# Altium schematic sheet [02].LORA.SchDoc
size 533 x 241 mm; Organization: Altium Limited; Address1: L3, 12a Rodborough Rd; Address2: Frenchs Forest; Address3: NSW; Address4: Australia 2086
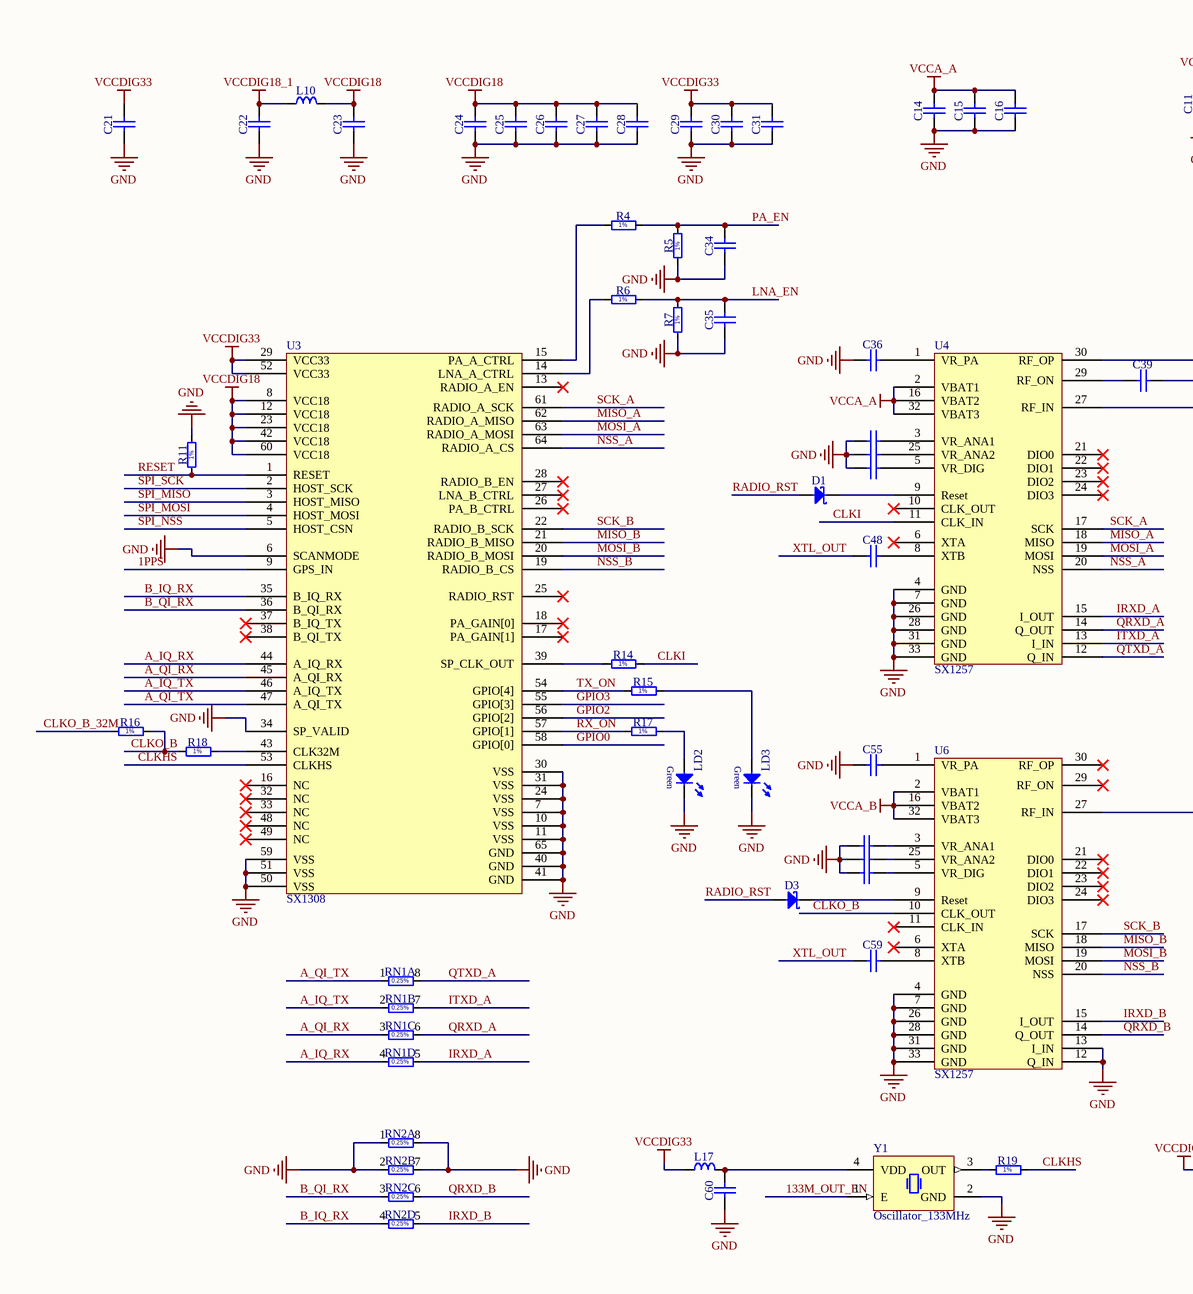
[diagram p0: [02].LORA.SchDoc, left]
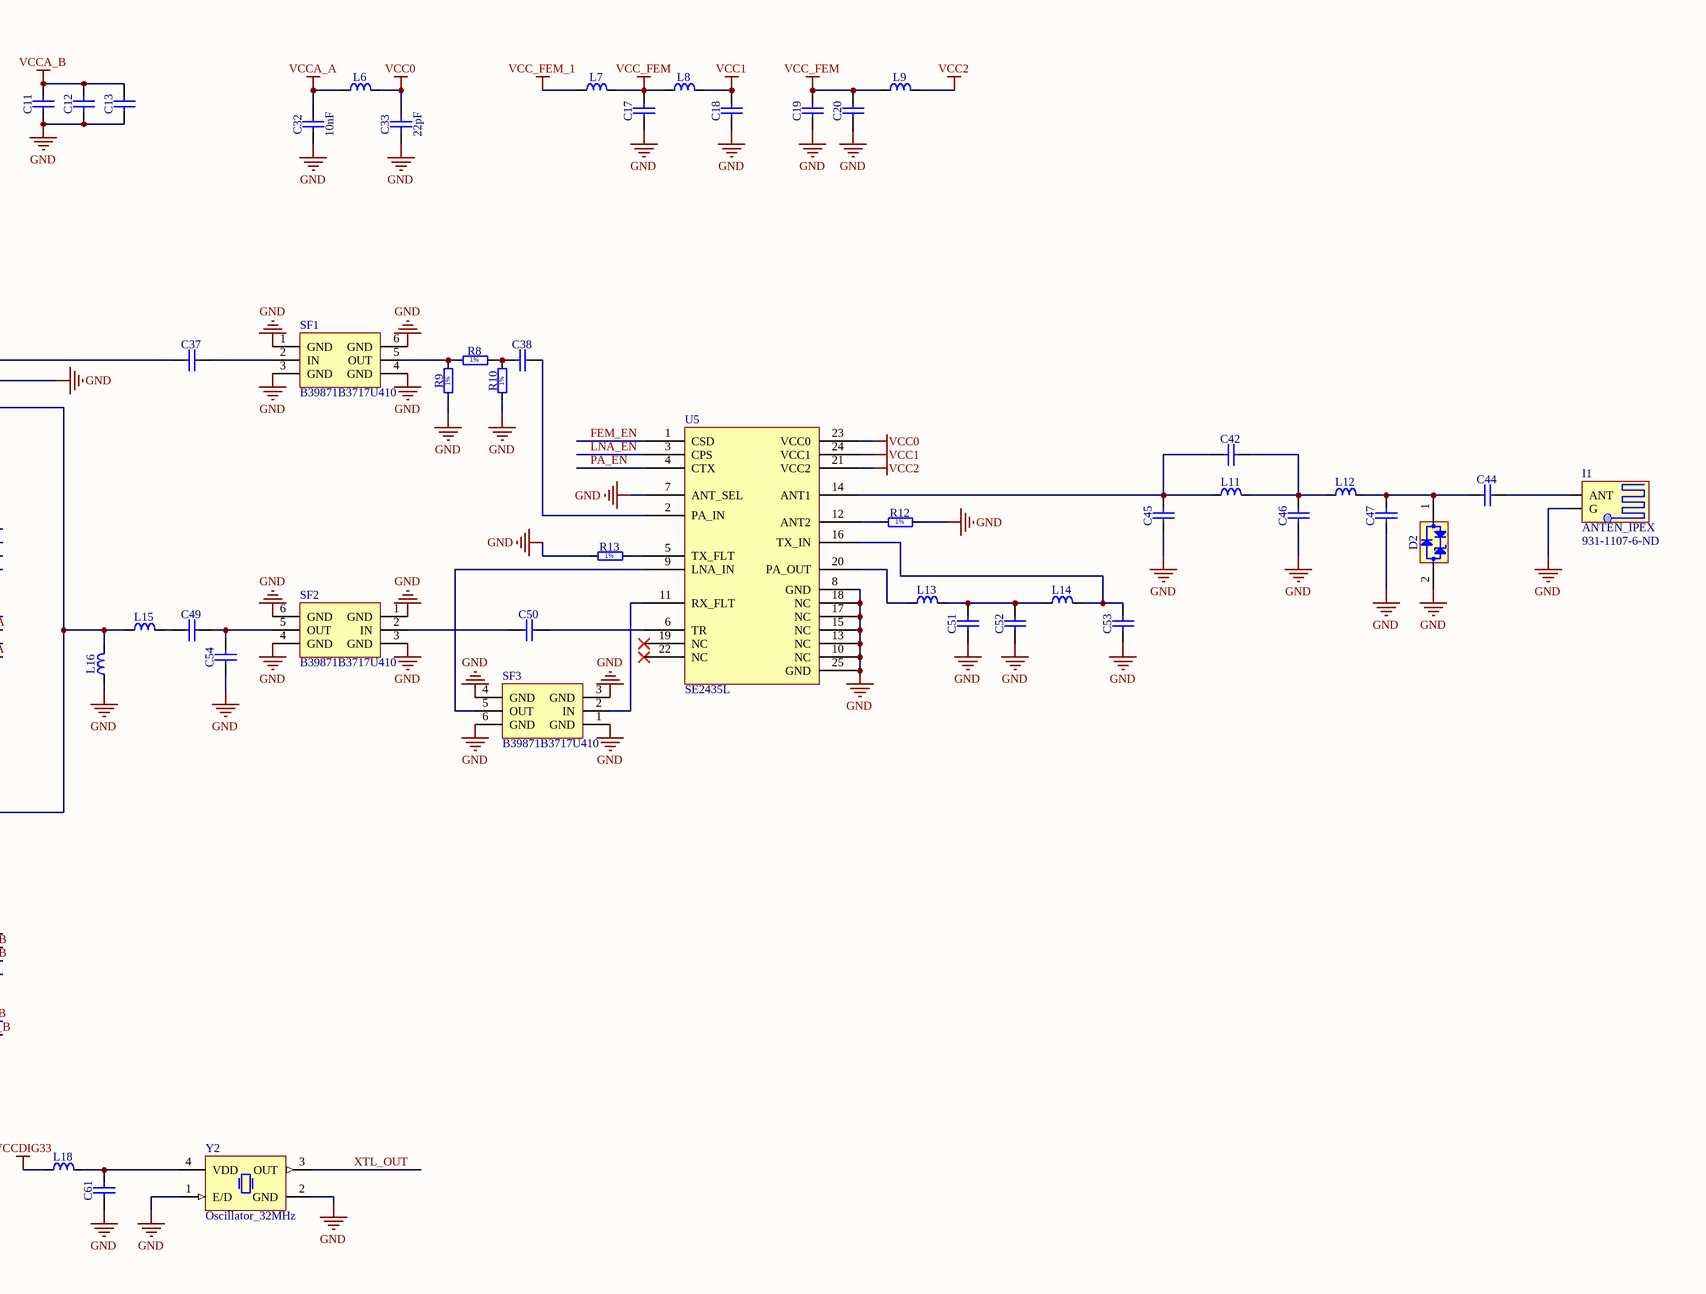
[diagram p1: [02].LORA.SchDoc, right]

## Parts
C11  100nF  [CAPC1005X55N]  (value not drawn)
C12  100nF  [CAPC1005X55N]  (value not drawn)
C13  100nF  [CAPC1005X55N]  (value not drawn)
C14  100nF  [CAPC1005X55N]  (value not drawn)
C15  100nF  [CAPC1005X55N]  (value not drawn)
C16  100nF  [CAPC1005X55N]  (value not drawn)
C17  4.7uF  [CAPC1005X55N]  (value not drawn)
C18  150pF  [CAPC1005X55N]  (value not drawn)
C19  1nF  [CAPC1005X55N]  (value not drawn)
C20  33pF  [CAPC1005X55N]  (value not drawn)
C21  10uF  [CAPC1005X55N]  (value not drawn)
C22  10uF  [CAPC1005X55N]  (value not drawn)
C23  1uF  [CAPC1005X55N]  (value not drawn)
C24  100nF  [CAPC1005X55N]  (value not drawn)
C25  100nF  [CAPC1005X55N]  (value not drawn)
C26  100nF  [CAPC1005X55N]  (value not drawn)
C27  100nF  [CAPC1005X55N]  (value not drawn)
C28  100nF  [CAPC1005X55N]  (value not drawn)
C29  100nF  [CAPC1005X55N]  (value not drawn)
C30  100nF  [CAPC1005X55N]  (value not drawn)
C31  100nF  [CAPC1005X55N]  (value not drawn)
C32  10nF  [CAPC1005X55N]
C33  22pF  [CAPC1005X55N]
C34  56pF  [CAPC1005X55N]  (value not drawn)
C35  56pF  [CAPC1005X55N]  (value not drawn)
C36  10uF  [CAPC1005X55N]  (value not drawn)
C37  56pF  [CAPC1005X55N]  (value not drawn)
C38  3.3pF  [CAPC1005X55N]  (value not drawn)
C39  56pF  [CAPC1005X55N]  (value not drawn)
C40  1uF  [CAPC1005X55N]  (value not drawn)
C41  1uF  [CAPC1005X55N]  (value not drawn)
C42  33pF  [CAPC1005X55N]  (value not drawn)
C43  1uF  [CAPC1005X55N]  (value not drawn)
C44  33pF  [CAPC1005X55N]  (value not drawn)
C45  33pF  [CAPC1005X55N]  (value not drawn)
C46  33pF  [CAPC1005X55N]  (value not drawn)
C47  33pF  [CAPC1005X55N]  (value not drawn)
C48  1uF  [CAPC1005X55N]  (value not drawn)
C49  56pF  [CAPC1005X55N]  (value not drawn)
C50  56pF  [CAPC1005X55N]  (value not drawn)
C51  33pF  [CAPC1005X55N]  (value not drawn)
C52  33pF  [CAPC1005X55N]  (value not drawn)
C53  33pF  [CAPC1005X55N]  (value not drawn)
C54  5.6pF  [CAPC1005X55N]  (value not drawn)
C55  10uF  [CAPC1005X55N]  (value not drawn)
C56  1uF  [CAPC1005X55N]  (value not drawn)
C57  1uF  [CAPC1005X55N]  (value not drawn)
C58  1uF  [CAPC1005X55N]  (value not drawn)
C59  1uF  [CAPC1005X55N]  (value not drawn)
C60  100nF  [CAPC1005X55N]  (value not drawn)
C61  100nF  [CAPC1005X55N]  (value not drawn)
D1  PMEG4002EB  [SODFL1608X65N]  (value not drawn)
D2  ESD5V3L1U-02LRH  [DFN100X60X40-2N]  (value not drawn)
D3  PMEG4002EB  [SODFL1608X65N]  (value not drawn)
I1  ANTEN_IPEX  Supplier Part Number 1: 931-1107-6-ND  [ANTEN_IPEX]
L6  1k@100MHz  [INDC1005X55N]  (value not drawn)
L7  600R@100MHz  [INDC1005X55N]  (value not drawn)
L8  1k@100MHz  [INDC1005X55N]  (value not drawn)
L9  1k@100MHz  [INDC1005X55N]  (value not drawn)
L10  600R@100MHz  [INDC1005X55N]  (value not drawn)
L11  1k@100MHz  [INDC1005X55N]  (value not drawn)
L12  1k@100MHz  [INDC1005X55N]  (value not drawn)
L13  1k@100MHz  [INDC1005X55N]  (value not drawn)
L14  1k@100MHz  [INDC1005X55N]  (value not drawn)
L15  1k@100MHz  [INDC1005X55N]  (value not drawn)
L16  1k@100MHz  [INDC1005X55N]  (value not drawn)
L17  600R@100MHz  [INDC1005X55N]  (value not drawn)
L18  600R@100MHz  [INDC1005X55N]  (value not drawn)
LD2  Green  [LED_OSRAM_LGL29K]  (value not drawn)
LD3  Green  [LED_OSRAM_LGL29K]  (value not drawn)
R4  100  [RESC1005X40N]  (value not drawn)
R5  0  [RESC1005X40N]  (value not drawn)
R6  100  [RESC1005X40N]  (value not drawn)
R7  0  [RESC1005X40N]  (value not drawn)
R8  18  [RESC1005X40N]  (value not drawn)
R9  300  [RESC1005X40N]  (value not drawn)
R10  300  [RESC1005X40N]  (value not drawn)
R11  10k  [RESC1005X40N]  (value not drawn)
R12  150  [RESC1005X40N]  (value not drawn)
R13  150  [RESC1005X40N]  (value not drawn)
R14  100  [RESC1005X40N]  (value not drawn)
R15  470  [RESC1005X40N]  (value not drawn)
R16  100  [RESC1005X40N]  (value not drawn)
R17  470  [RESC1005X40N]  (value not drawn)
R18  100  [RESC1005X40N]  (value not drawn)
R19  0  [RESC1005X40N]  (value not drawn)
RN1  100  [RN_VISHAY_ACAS0612]  (value not drawn)  (parts A,B,C,D of 4)
RN2  100  [RN_VISHAY_ACAS0612]  (value not drawn)  (parts A,B,C,D of 4)
SF1  B39871B3717U410  [SAW_Filter]
SF2  B39871B3717U410  [SAW_Filter]
SF3  B39871B3717U410  [SAW_Filter]
U3  SX1308  [SX1308]
U4  SX1257  [SX1257]
U5  SE2435L  [SE2435L]
U6  SX1257  [SX1257]
Y1  Oscillator_133MHz  [OSCILLATOR_133MHz]
Y2  Oscillator_32MHz  [TCXO_32MHz]

## Nets
GND: C11.1 C12.1 C13.1 C14.1 C15.1 C16.1 C17.1 C18.1 C19.1 C20.1 C21.1 C22.1 C23.1 C24.1 C25.1 C26.1 C27.1 C28.1 C29.1 C30.1 C31.1 C32.1 C33.1 C34.1 C35.1 C36.1 C39.2 C40.1 C41.1 C43.1 C45.1 C46.1 C47.1 C51.1 C52.1 C53.1 C54.1 C55.1 C56.1 C57.1 C58.1 C60.1 C61.1 D2.2(I/O1) I1.2(G) L16.1 LD2.1(C) LD3.1(C) R5.1 R7.1 R9.1 R10.1 R11.2 R12.2 R13.1 RN2.1 RN2.2 RN2.7 RN2.8 SF1.1(GND) SF1.3(GND) SF1.4(GND) SF1.6(GND) SF2.1(GND) SF2.3(GND) SF2.4(GND) SF2.6(GND) SF3.1(GND) SF3.3(GND) SF3.4(GND) SF3.6(GND) U3.6(SCANMODE) U3.7(VSS) U3.10(VSS) U3.11(VSS) U3.24(VSS) U3.30(VSS) U3.31(VSS) U3.34(SP_VALID) U3.40(GND) U3.41(GND) U3.50(VSS) U3.51(VSS) U3.59(VSS) U3.65(GND) U4.4(GND) U4.7(GND) U4.26(GND) U4.28(GND) U4.31(GND) U4.33(GND) U5.7(ANT_SEL) U5.8(GND) U5.10(NC) U5.13(NC) U5.15(NC) U5.17(NC) U5.18(NC) U5.25(GND) U6.4(GND) U6.7(GND) U6.12(Q_IN) U6.13(I_IN) U6.26(GND) U6.28(GND) U6.31(GND) U6.33(GND) Y1.2(GND) Y2.1(E/D) Y2.2(GND)
VCC0: C33.2 L6.2 U5.23(VCC0)
VCC1: C18.2 L8.2 U5.24(VCC1)
VCC2: L9.2 U5.21(VCC2)
VCC_FEM: C17.2 C19.2 C20.2 L7.2 L8.1 L9.1
VCC_FEM_1: L7.1
VCCA_A: C14.2 C15.2 C16.2 C32.2 L6.1 U4.2(VBAT1) U4.16(VBAT2) U4.32(VBAT3)
VCCA_B: C11.2 C12.2 C13.2 U6.2(VBAT1) U6.16(VBAT2) U6.32(VBAT3)
VCCDIG18: C23.2 C24.2 C25.2 C26.2 C27.2 C28.2 L10.2 U3.8(VCC18) U3.12(VCC18) U3.23(VCC18) U3.42(VCC18) U3.60(VCC18)
VCCDIG18_1: C22.2 L10.1
VCCDIG33: C21.2 C29.2 C30.2 C31.2 L17.1 L18.1 U3.29(VCC33) U3.52(VCC33)
1PPS: U3.9(GPS_IN)
133M_OUT_EN: Y1.1(E)
A_IQ_RX: RN1.4 U3.44(A_IQ_RX)
A_IQ_TX: RN1.2 U3.46(A_IQ_TX)
A_QI_RX: RN1.3 U3.45(A_QI_RX)
A_QI_TX: RN1.1 U3.47(A_QI_TX)
B_IQ_RX: RN2.4 U3.35(B_IQ_RX)
B_QI_RX: RN2.3 U3.36(B_QI_RX)
CLKHS: R19.2 U3.53(CLKHS)
CLKI: R14.2 U4.11(CLK_IN)
CLKO_B: R16.2 R18.1 U6.10(CLK_OUT)
CLKO_B_32M: R16.1
FEM_EN: U5.1(CSD)
GPIO0: U3.58(GPIO[0])
GPIO2: U3.56(GPIO[2])
GPIO3: U3.55(GPIO[3])
IRXD_A: RN1.5 U4.15(I_OUT)
IRXD_B: RN2.5 U6.15(I_OUT)
ITXD_A: RN1.7 U4.13(I_IN)
LNA_EN: C35.2 R6.2 R7.2 U5.3(CPS)
MISO_A: U3.62(RADIO_A_MISO) U4.18(MISO)
MISO_B: U3.21(RADIO_B_MISO) U6.18(MISO)
MOSI_A: U3.63(RADIO_A_MOSI) U4.19(MOSI)
MOSI_B: U3.20(RADIO_B_MOSI) U6.19(MOSI)
NSS_A: U3.64(RADIO_A_CS) U4.20(NSS)
NSS_B: U3.19(RADIO_B_CS) U6.20(NSS)
PA_EN: C34.2 R4.2 R5.2 U5.4(CTX)
QRXD_A: RN1.6 U4.14(Q_OUT)
QRXD_B: RN2.6 U6.14(Q_OUT)
QTXD_A: RN1.8 U4.12(Q_IN)
RADIO_RST: D1.2(A) D3.2(A)
RESET: R11.1 U3.1(RESET)
RX_ON: R17.1 U3.57(GPIO[1])
SCK_A: U3.61(RADIO_A_SCK) U4.17(SCK)
SCK_B: U3.22(RADIO_B_SCK) U6.17(SCK)
SPI_MISO: U3.3(HOST_MISO)
SPI_MOSI: U3.4(HOST_MOSI)
SPI_NSS: U3.5(HOST_CSN)
SPI_SCK: U3.2(HOST_SCK)
TX_ON: R15.1 U3.54(GPIO[4])
XTL_OUT: C48.1 C59.1 Y2.3(OUT)
NetC36_2: C36.2 U4.1(VR_PA)
NetC37_1: C37.1 U4.30(RF_OP)
NetC37_2: C37.2 SF1.2(IN)
NetC38_1: C38.1 R8.2 R10.2
NetC38_2: C38.2 U5.2(PA_IN)
NetC39_1: C39.1 U4.29(RF_ON)
NetC40_2: C40.2 U4.3(VR_ANA1)
NetC41_2: C41.2 U4.25(VR_ANA2)
NetC42_1: C42.1 C45.2 L11.1 U5.14(ANT1)
NetC42_2: C42.2 C46.2 L11.2 L12.1
NetC43_2: C43.2 U4.5(VR_DIG)
NetC44_1: C44.1 C47.2 D2.1(GND) L12.2
NetC44_2: C44.2 I1.1(ANT)
NetC48_2: C48.2 U4.8(XTB)
NetC49_1: C49.1 L15.2
NetC49_2: C49.2 C54.2 SF2.5(OUT)
NetC50_1: C50.1 SF2.2(IN)
NetC50_2: C50.2 U5.6(TR)
NetC51_2: C51.2 C52.2 L13.2 L14.1
NetC53_2: C53.2 L14.2 U5.16(TX_IN)
NetC55_2: C55.2 U6.1(VR_PA)
NetC56_2: C56.2 U6.3(VR_ANA1)
NetC57_2: C57.2 U6.25(VR_ANA2)
NetC58_2: C58.2 U6.5(VR_DIG)
NetC59_2: C59.2 U6.8(XTB)
NetC60_2: C60.2 L17.2 Y1.4(VDD)
NetC61_2: C61.2 L18.2 Y2.4(VDD)
NetD1_1: D1.1(C) U4.9(Reset)
NetD3_1: D3.1(C) U6.9(Reset)
NetL13_1: L13.1 U5.20(PA_OUT)
NetL15_1: L15.1 L16.2 U4.27(RF_IN) U6.27(RF_IN)
NetLD2_2: LD2.2(A) R17.2
NetLD3_2: LD3.2(A) R15.2
NetR4_1: R4.1 U3.15(PA_A_CTRL)
NetR6_1: R6.1 U3.14(LNA_A_CTRL)
NetR8_1: R8.1 R9.2 SF1.5(OUT)
NetR12_1: R12.1 U5.12(ANT2)
NetR13_2: R13.2 U5.5(TX_FLT)
NetR14_1: R14.1 U3.39(SP_CLK_OUT)
NetR18_2: R18.2 U3.43(CLK32M)
NetR19_1: R19.1 Y1.3(OUT)
NetSF3_2: SF3.2(IN) U5.11(RX_FLT)
NetSF3_5: SF3.5(OUT) U5.9(LNA_IN)

Not connected (* = marked no-connect by the designer): U3 13(RADIO_A_EN)* 16(NC)* 17(PA_GAIN[1])* 18(PA_GAIN[0])* 25(RADIO_RST)* 26(PA_B_CTRL)* 27(LNA_B_CTRL)* 28(RADIO_B_EN)* 32(NC)* 33(NC)* 37(B_IQ_TX)* 38(B_QI_TX)* 48(NC)* 49(NC)*; U4 6(XTA)* 10(CLK_OUT)* 21(DIO0)* 22(DIO1)* 23(DIO2)* 24(DIO3)*; U5 19(NC)* 22(NC)*; U6 6(XTA)* 11(CLK_IN)* 21(DIO0)* 22(DIO1)* 23(DIO2)* 24(DIO3)* 29(RF_ON)* 30(RF_OP)*

## Notes on the sheet
- Title
- Size:
- Date:
- B
- Number:
- Time:
- Revision:
- Sheet
- of
- File:
- (in symbol R0402_0R_JUMPER) 1%
- (in symbol R0402_10K_1%_0.0625W_100PPM) 1%
- (in symbol R0402_18R_1%_0.0625W_100PPM) 1%
- (in symbol R0402_100R_1%_0.0625W_100PPM) 1%
- (in symbol R0402_150R_1%_0.0625W_100PPM) 1%
- (in symbol R0402_300R_1%_0.0625W_100PPM) 1%
- (in symbol R0402_470R_1%_0.0625W_100PPM) 1%
- (in symbol RN_100R_VISHAY_ACASA1000E1000P100, part A) 0.25%
- (in symbol RN_100R_VISHAY_ACASA1000E1000P100, part B) 0.25%
- (in symbol RN_100R_VISHAY_ACASA1000E1000P100, part C) 0.25%
- (in symbol RN_100R_VISHAY_ACASA1000E1000P100, part D) 0.25%

## Library data of the parts
C11-C16 C24-C31 C60 C61 = CC0402_100NF_16V_10%_X7R: Non-polarised capacitor; Part Description: SMD Multilayer Chip Ceramic Capacitor; Manufacturer: GENERIC; Manufacturer1 Part Number: 223878715649; Voltage: 16V; TC: X7R; Tolerance: ±10%; Table: Capacitors SMD; Part Number: CC0402_100NF_16V_10%_X7R; Component Kind: Standard; Component Type: Standard; Pin Count: 2; Value: 100nF; Status: Not Recommended; Manufacturer Part Number: CC0402_100NF_16V_10%_X7R; Case: 0402; Mounted: Yes; Socket: No; SMD: Yes; Manufacturer1 Example: PHYCOMP; Manufacturer1 ComponentHeight: 0.55mm; HelpURL: \\cern.ch\dfs\Applications\Altium\Datasheets\CC0402_X7R_PHYCOMP.pdf; Author: CERN DEM JLC; CreateDate: 12/3/2007; LatestRevisionDate: 12/3/2007
C17 = CC0402_4.7UF_4V_20%_X5R: Non-polarised capacitor; Part Description: SMD Multilayer Chip Ceramic Capacitor; Manufacturer: GENERIC; Manufacturer1 Part Number: C0402C475M7PAC; Voltage: 4V; TC: X5R; Tolerance: ±20%; Table: Capacitors SMD; Part Number: CC0402_4.7UF_4V_20%_X5R; Component Kind: Standard; Component Type: Standard; Pin Count: 2; Value: 4.7uF; Status: Preferred; Manufacturer Part Number: CC0402_4.7UF_4V_20%_X5R; Case: 0402; Mounted: Yes; Socket: No; SMD: Yes; Manufacturer1 Example: KEMET; Manufacturer1 ComponentHeight: 0.55mm; HelpURL: \\cern.ch\dfs\Applications\Altium\Datasheets\CC0402_X5R_KEMET.pdf; Author: CERN DEM JLC; CreateDate: 6/8/2010; LatestRevisionDate: 6/8/2010
C18 = CC0402_150PF_50V_5%_NP0: Non-polarised capacitor; Part Description: SMD Multilayer Chip Ceramic Capacitor; Manufacturer: GENERIC; Manufacturer1 Part Number: 223886915151; Voltage: 50V; TC: NP0; Tolerance: ±5%; Table: Capacitors SMD; Part Number: CC0402_150PF_50V_5%_NP0; Component Kind: Standard; Component Type: Standard; Pin Count: 2; Value: 150pF; Status: Not Recommended; Manufacturer Part Number: CC0402_150PF_50V_5%_NP0; Case: 0402; Mounted: Yes; Socket: No; SMD: Yes; Manufacturer1 Example: PHYCOMP; Manufacturer1 ComponentHeight: 0.55mm; HelpURL: \\cern.ch\dfs\Applications\Altium\Datasheets\CC0402_NP0_PHYCOMP.pdf; Author: CERN DEM JLC; CreateDate: 12/3/2007; LatestRevisionDate: 12/3/2007
C19 = CC0402_1NF_50V_10%_X7R: Non-polarised capacitor; Part Description: SMD Multilayer Chip Ceramic Capacitor; Manufacturer: GENERIC; Manufacturer1 Part Number: 223858715623; Voltage: 50V; TC: X7R; Tolerance: ±10%; Table: Capacitors SMD; Part Number: CC0402_1NF_50V_10%_X7R; Component Kind: Standard; Component Type: Standard; Pin Count: 2; Value: 1nF; Status: Not Recommended; Manufacturer Part Number: CC0402_1NF_50V_10%_X7R; Case: 0402; Mounted: Yes; Socket: No; SMD: Yes; Manufacturer1 Example: PHYCOMP; Manufacturer1 ComponentHeight: 0.55mm; HelpURL: \\cern.ch\dfs\Applications\Altium\Datasheets\CC0402_X7R_PHYCOMP.pdf; Author: CERN DEM JLC; CreateDate: 12/3/2007; LatestRevisionDate: 12/3/2007
C20 C42 C44-C47 C51-C53 = CC0402_33PF_50V_5%_NP0: Non-polarised capacitor; Part Description: SMD Multilayer Chip Ceramic Capacitor; Manufacturer: GENERIC; Manufacturer1 Part Number: 223886915339; Voltage: 50V; TC: NP0; Tolerance: ±5%; Table: Capacitors SMD; Part Number: CC0402_33PF_50V_5%_NP0; Component Kind: Standard; Component Type: Standard; Pin Count: 2; Value: 33pF; Status: Not Recommended; Manufacturer Part Number: CC0402_33PF_50V_5%_NP0; Case: 0402; Mounted: Yes; Socket: No; SMD: Yes; Manufacturer1 Example: PHYCOMP; Manufacturer1 ComponentHeight: 0.55mm; HelpURL: \\cern.ch\dfs\Applications\Altium\Datasheets\CC0402_NP0_PHYCOMP.pdf; Author: CERN DEM JLC; CreateDate: 12/3/2007; LatestRevisionDate: 12/3/2007
C21 C22 C36 C55 = CC0603_10UF_6.3V_20%_X5R: Non-polarised capacitor; Part Description: SMD Multilayer Chip Ceramic Capacitor; Manufacturer: GENERIC; Manufacturer1 Part Number: C0603C106M9PAC; Voltage: 6.3V; TC: X5R; Tolerance: ±20%; Table: Capacitors SMD; Part Number: CC0603_10UF_6.3V_20%_X5R; Component Kind: Standard; Component Type: Standard; Footprint: CAPC1608X87N; Pin Count: 2; Value: 10uF; Status: Preferred; Manufacturer Part Number: CC0603_10uF_6.3V_20%_X5R; Case: 0603; Mounted: Yes; Socket: No; SMD: Yes; Manufacturer1 Example: KEMET; Manufacturer1 ComponentHeight: 0.95mm; HelpURL: \\cern.ch\dfs\Applications\Altium\Datasheets\CC0603_X5R_KEMET.pdf; Author: CERN DEM JLC; CreateDate: 12/3/2007; LatestRevisionDate: 12/3/2007
C23 C40 C41 C43 C48 C56-C59 = CC0402_1UF_16V_10%_X5R: Non-polarised capacitor; Part Description: SMD Multilayer Chip Ceramic Capacitor; Manufacturer: GENERIC; Manufacturer1 Part Number: C1005X5R1C105KT; Voltage: 16V; TC: X5R; Tolerance: ±10%; Table: Capacitors SMD; Part Number: CC0402_1UF_16V_10%_X5R; Component Kind: Standard; Component Type: Standard; Pin Count: 2; Value: 1uF; Status: Preferred; Manufacturer Part Number: CC0402_1UF_16V_10%_X5R; Case: 0402; Mounted: Yes; Socket: No; SMD: Yes; Manufacturer1 Example: TDK; Manufacturer1 ComponentHeight: 0.55mm; HelpURL: \\cern.ch\dfs\Applications\Altium\Datasheets\CC0402_X5R_TDK_C.pdf; Author: CERN DEM JLC; CreateDate: 10/25/2012; LatestRevisionDate: 10/25/2012
C32 = CC0402_10NF_25V_10%_X7R: Non-polarised capacitor; Part Description: SMD Multilayer Chip Ceramic Capacitor; Manufacturer: GENERIC; Manufacturer1 Part Number: C1005X7R1E103KT; Voltage: 25V; TC: X7R; Tolerance: ±10%; Table: Capacitors SMD; Part Number: CC0402_10NF_25V_10%_X7R; Component Kind: Standard; Component Type: Standard; Pin Count: 2; Value: 10nF; Status: Preferred; Manufacturer Part Number: CC0402_10NF_25V_10%_X7R; Case: 0402; Mounted: Yes; Socket: No; SMD: Yes; Manufacturer1 Example: TDK; Manufacturer1 ComponentHeight: 0.55mm; HelpURL: \\cern.ch\dfs\Applications\Altium\Datasheets\CC0402_X7R_TDK_C.pdf; Author: CERN DEM JLC; CreateDate: 10/25/2012; LatestRevisionDate: 10/25/2012
C33 = CC0402_22PF_50V_5%_NP0: Non-polarised capacitor; Part Description: SMD Multilayer Chip Ceramic Capacitor; Manufacturer: GENERIC; Manufacturer1 Part Number: 223886915229; Voltage: 50V; TC: NP0; Tolerance: ±5%; Table: Capacitors SMD; Part Number: CC0402_22PF_50V_5%_NP0; Component Kind: Standard; Component Type: Standard; Pin Count: 2; Value: 22pF; Status: Not Recommended; Manufacturer Part Number: CC0402_22PF_50V_5%_NP0; Case: 0402; Mounted: Yes; Socket: No; SMD: Yes; Manufacturer1 Example: PHYCOMP; Manufacturer1 ComponentHeight: 0.55mm; HelpURL: \\cern.ch\dfs\Applications\Altium\Datasheets\CC0402_NP0_PHYCOMP.pdf; Author: CERN DEM JLC; CreateDate: 12/3/2007; LatestRevisionDate: 12/3/2007
C34 C35 C37 C39 C49 C50 = CC0603_56PF_50V_5%_NP0: Non-polarised capacitor; Part Description: SMD Multilayer Chip Ceramic Capacitor; Manufacturer: GENERIC; Manufacturer1 Part Number: 223886715569; Voltage: 50V; TC: NP0; Tolerance: ±5%; Table: Capacitors SMD; Part Number: CC0603_56PF_50V_5%_NP0; Component Kind: Standard; Component Type: Standard; Footprint: CAPC1608X87N; Pin Count: 2; Value: 56pF; Status: Preferred; Manufacturer Part Number: CC0603_56PF_50V_5%_NP0; Case: 0603; Mounted: Yes; Socket: No; SMD: Yes; Manufacturer1 Example: PHYCOMP; Manufacturer1 ComponentHeight: 0.87mm; HelpURL: \\cern.ch\dfs\Applications\Altium\Datasheets\CC0603_NP0_PHYCOMP.pdf; Author: CERN DEM JLC; CreateDate: 12/3/2007; LatestRevisionDate: 12/3/2007
C38 = CC0402_3.3PF_50V_0.25PF_NP0: Non-polarised capacitor; Part Description: SMD Multilayer Chip Ceramic Capacitor; Manufacturer: GENERIC; Manufacturer1 Part Number: 223886915338; Voltage: 50V; TC: NP0; Tolerance: ±0.25pF; Table: Capacitors SMD; Part Number: CC0402_3.3PF_50V_0.25PF_NP0; Component Kind: Standard; Component Type: Standard; Pin Count: 2; Value: 3.3pF; Status: Not Recommended; Manufacturer Part Number: CC0402_3.3PF_50V_0.25PF_NP0; Case: 0402; Mounted: Yes; Socket: No; SMD: Yes; Manufacturer1 Example: PHYCOMP; Manufacturer1 ComponentHeight: 0.55mm; HelpURL: \\cern.ch\dfs\Applications\Altium\Datasheets\CC0402_NP0_PHYCOMP.pdf; Author: CERN DEM JLC; CreateDate: 12/3/2007; LatestRevisionDate: 12/3/2007
C54 = CC0603_5.6PF_50V_0.5PF_NP0: Non-polarised capacitor; Part Description: SMD Multilayer Chip Ceramic Capacitor; Manufacturer: GENERIC; Manufacturer1 Part Number: 223886715568; Voltage: 50V; TC: NP0; Tolerance: ±0.5pF; Table: Capacitors SMD; Part Number: CC0603_5.6PF_50V_0.5PF_NP0; Component Kind: Standard; Component Type: Standard; Footprint: CAPC1608X87N; Pin Count: 2; Value: 5.6pF; Status: Preferred; Manufacturer Part Number: CC0603_5.6PF_50V_0.5PF_NP0; Case: 0603; Mounted: Yes; Socket: No; SMD: Yes; Manufacturer1 Example: PHYCOMP; Manufacturer1 ComponentHeight: 0.87mm; HelpURL: \\cern.ch\dfs\Applications\Altium\Datasheets\CC0603_NP0_PHYCOMP.pdf; Author: CERN DEM JLC; CreateDate: 12/3/2007; LatestRevisionDate: 12/3/2007
D1 D3 = PMEG4002EB: Schottky Diode; Part Description: Very Low VF MEGA Schottky Barrier Rectifier; Manufacturer: NXP SEMICONDUCTORS; Voltage: 40V; Power: 200mA; Table: Diodes; Part Number: PMEG4002EB; Component Kind: Standard; Component Type: Standard; Device: PMEG4002EB; PackageDescription: Ultra Small Outline Diode Flat Lead (SOD-523), Body; 1.2mm L X 0.8mm W X 0.65mm H, IPC Medium Density; Manufacturer Part Number: PMEG4002EB; Pin Count: 2; Case: SOD523; Mounted: Yes; Socket: No; SMD: Yes; ComponentHeight: 0.65mm; HelpURL: \\cern.ch\dfs\Applications\Altium\Datasheets\PMEG4002EB.pdf; Author: CERN DEM JMW; CreateDate: 4/21/2009; LatestRevisionDate: 5/7/2009
D2 = ESD5V3L1U-02LRH: 30kV ESD Low Capacitance TVS Diode; Part Description: 30kV ESD Low Capacitance Uni-Directional TVS Diode; Manufacturer: INFINEON; Voltage: 5.3V; Table: Diodes; Part Number: ESD5V3L1U-02LRH; Component Kind: Standard; Component Type: Standard; Device: ESD5V3L1U-02LRH; PackageDescription: DFN; 2 pin,1.00mm L X 0.60mm W X 0.40mm H, IPC Medium Density; Manufacturer Part Number: ESD5V3L1U-02LRH; Pin Count: 2; Case: DFN2; Mounted: Yes; Socket: No; SMD: Yes; ComponentHeight: 0.4mm; HelpURL: \\cern.ch\dfs\Applications\Altium\Datasheets\ESD5V3L1U-02LRH.pdf; Author: CERN DEM JLC; CreateDate: 3/13/2012; LatestRevisionDate: 3/13/2012
I1 = ANTEN_IPEX: CONN UMC RCPT STR 50 OHM SMD; Manufacturer: Taoglas; Manufacturer Part Number: RECE.20279.001E.01; Body Material: Brass; Body Plating: Gold; Connector Type: Coaxial,Male Pin; Gender: Male; Supplier 1: Digi-Key; Stock 1: 45630; Pricing 1: 1=0.75 (USD); Mount: Surface Mount; Case/Package: SMD/SMT; Contact Material: Brass; Contact Plating: Gold; Housing Color: White; Package Quantity: 1; Packaging: Tape and Reel; Termination: Solder; Orientation: Straight; Fastening Type: Snap
L6 L8 L9 L11-L16 = IND0402_MURATA_BLM15HD102SN1: Inductor; Part Description: SMD EMIFIL Suppression Chip Ferrite Bead; Manufacturer: MURATA; Manufacturer Part Number: BLM15HD102SN1D; Power: 250mA; Resistance: 1.25R; Tolerance: ±25%; Table: Inductors SMD; Part Number: IND0402_MURATA_BLM15HD102SN1; Component Kind: Standard; Component Type: Standard; Pin Count: 2; Value: 1k@100MHz; Status: None; Case: 0402; Mounted: Yes; Socket: No; SMD: Yes; ComponentHeight: 0.55mm; HelpURL: \\cern.ch\dfs\Applications\Altium\Datasheets\IND0402_MURATA_BLM15H.pdf; Author: CERN DEM JLC; CreateDate: 3/6/2012; LatestRevisionDate: 3/6/2012
L7 L10 L17 L18 = IND0402_MURATA_BLM15HD601SN1: Inductor; Part Description: SMD EMIFIL Suppression Chip Ferrite Bead; Manufacturer: MURATA; Manufacturer Part Number: BLM15HD601SN1D; Power: 300mA; Resistance: 0.85R; Tolerance: ±25%; Table: Inductors SMD; Part Number: IND0402_MURATA_BLM15HD601SN1; Component Kind: Standard; Component Type: Standard; Pin Count: 2; Value: 600R@100MHz; Status: None; Case: 0402; Mounted: Yes; Socket: No; SMD: Yes; ComponentHeight: 0.55mm; HelpURL: \\cern.ch\dfs\Applications\Altium\Datasheets\IND0402_MURATA_BLM15H.pdf; Author: CERN DEM JLC; CreateDate: 2/28/2012; LatestRevisionDate: 2/28/2012
LD2 LD3 = LED_OSRAM_LG L29K-G2J1-24-Z: LED Green 1C 2A; Part Description: Surface Mount Green LED (0603 Case); Manufacturer: OSRAM; Table: LEDs & Displays; Part Number: LED_OSRAM_LG L29K-G2J1-24-Z; Component Kind: Standard; Component Type: Standard; Color: Green; PackageDescription: Green Chip LED, 2-Leads, Body 1.7x0.8mm, IPC Medium Density; Manufacturer Part Number: LG L29K-G2J1-24-Z; Pin Count: 2; Case: 0603; Mounted: Yes; Socket: No; SMD: Yes; ComponentHeight: 0.67mm; HelpURL: \\cern.ch\dfs\Applications\Altium\Datasheets\LED_OSRAM_LGL29K.pdf; Author: CERN DEM JLC; CreateDate: 4/24/2012; LatestRevisionDate: 4/24/2012
R4 R6 R14 R16 R18 = R0402_100R_1%_0.0625W_100PPM: Resistor - 1%; Part Description: General Purpose Thick Film Chip Resistor; Manufacturer: GENERIC; Manufacturer1 Part Number: 232270671001L; TC: ±100ppm/°C; Table: Resistors SMD; Part Number: R0402_100R_1%_0.0625W_100PPM; Component Kind: Standard; Component Type: Standard; Pin Count: 2; Value: 100; Status: Not recommended; Power: 0.0625W; Tolerance: ±1%; Manufacturer Part Number: R0402_100R_1%_0.0625W_100PPM; Case: 0402; Mounted: Yes; Socket: No; SMD: Yes; Manufacturer1 Example: YAGEO PHYCOMP; Manufacturer1 ComponentHeight: 0.4mm; HelpURL: \\cern.ch\dfs\Applications\Altium\Datasheets\R0402_Phycomp_RC0402.pdf; Author: CERN DEM JLC; CreateDate: 12/3/2007; LatestRevisionDate: 10/17/2012
R5 R7 R19 = R0402_0R_JUMPER: Resistor - 1%; Part Description: 1A (0.05R Max DC Resistance) Zero Ohm Jumper; Manufacturer: GENERIC; Manufacturer1 Part Number: 232270591001L; Table: Resistors SMD; Part Number: R0402_0R_JUMPER; Component Kind: Standard; Component Type: Standard; Pin Count: 2; Value: 0; Status: Not recommended; Manufacturer Part Number: R0402_0R_JUMPER; Case: 0402; Mounted: Yes; Socket: No; SMD: Yes; Manufacturer1 Example: YAGEO PHYCOMP; Manufacturer1 ComponentHeight: 0.4mm; HelpURL: \\cern.ch\dfs\Applications\Altium\Datasheets\R0402_Phycomp_RC0402.pdf; Author: CERN DEM JLC; CreateDate: 12/3/2007; LatestRevisionDate: 10/17/2012
R8 = R0402_18R_1%_0.0625W_100PPM: Resistor - 1%; Part Description: General Purpose Thick Film Chip Resistor; Manufacturer: GENERIC; Manufacturer1 Part Number: 232270671809L; TC: ±100ppm/°C; Table: Resistors SMD; Part Number: R0402_18R_1%_0.0625W_100PPM; Component Kind: Standard; Component Type: Standard; Pin Count: 2; Value: 18; Status: Not recommended; Power: 0.0625W; Tolerance: ±1%; Manufacturer Part Number: R0402_18R_1%_0.0625W_100PPM; Case: 0402; Mounted: Yes; Socket: No; SMD: Yes; Manufacturer1 Example: YAGEO PHYCOMP; Manufacturer1 ComponentHeight: 0.4mm; HelpURL: \\cern.ch\dfs\Applications\Altium\Datasheets\R0402_Phycomp_RC0402.pdf; Author: CERN DEM JLC; CreateDate: 12/3/2007; LatestRevisionDate: 10/17/2012
R9 R10 = R0402_300R_1%_0.0625W_100PPM: Resistor - 1%; Part Description: General Purpose Thick Film Chip Resistor; Manufacturer: GENERIC; Manufacturer1 Part Number: 232270673001L; TC: ±100ppm/°C; Table: Resistors SMD; Part Number: R0402_300R_1%_0.0625W_100PPM; Component Kind: Standard; Component Type: Standard; Pin Count: 2; Value: 300; Status: Not recommended; Power: 0.0625W; Tolerance: ±1%; Manufacturer Part Number: R0402_300R_1%_0.0625W_100PPM; Case: 0402; Mounted: Yes; Socket: No; SMD: Yes; Manufacturer1 Example: YAGEO PHYCOMP; Manufacturer1 ComponentHeight: 0.4mm; HelpURL: \\cern.ch\dfs\Applications\Altium\Datasheets\R0402_Phycomp_RC0402.pdf; Author: CERN DEM JLC; CreateDate: 12/3/2007; LatestRevisionDate: 10/17/2012
R11 = R0402_10K_1%_0.0625W_100PPM: Resistor - 1%; Part Description: General Purpose Thick Film Chip Resistor; Manufacturer: GENERIC; Manufacturer1 Part Number: 232270671003L; TC: ±100ppm/°C; Table: Resistors SMD; Part Number: R0402_10K_1%_0.0625W_100PPM; Component Kind: Standard; Component Type: Standard; Pin Count: 2; Value: 10k; Status: Not recommended; Power: 0.0625W; Tolerance: ±1%; Manufacturer Part Number: R0402_10K_1%_0.0625W_100PPM; Case: 0402; Mounted: Yes; Socket: No; SMD: Yes; Manufacturer1 Example: YAGEO PHYCOMP; Manufacturer1 ComponentHeight: 0.4mm; HelpURL: \\cern.ch\dfs\Applications\Altium\Datasheets\R0402_Phycomp_RC0402.pdf; Author: CERN DEM JLC; CreateDate: 12/3/2007; LatestRevisionDate: 10/17/2012
R12 R13 = R0402_150R_1%_0.0625W_100PPM: Resistor - 1%; Part Description: General Purpose Thick Film Chip Resistor; Manufacturer: GENERIC; Manufacturer1 Part Number: 232270671501L; TC: ±100ppm/°C; Table: Resistors SMD; Part Number: R0402_150R_1%_0.0625W_100PPM; Component Kind: Standard; Component Type: Standard; Pin Count: 2; Value: 150; Status: Not recommended; Power: 0.0625W; Tolerance: ±1%; Manufacturer Part Number: R0402_150R_1%_0.0625W_100PPM; Case: 0402; Mounted: Yes; Socket: No; SMD: Yes; Manufacturer1 Example: YAGEO PHYCOMP; Manufacturer1 ComponentHeight: 0.4mm; HelpURL: \\cern.ch\dfs\Applications\Altium\Datasheets\R0402_Phycomp_RC0402.pdf; Author: CERN DEM JLC; CreateDate: 12/3/2007; LatestRevisionDate: 10/17/2012
R15 R17 = R0402_470R_1%_0.0625W_100PPM: Resistor - 1%; Part Description: General Purpose Thick Film Chip Resistor; Manufacturer: GENERIC; Manufacturer1 Part Number: 232270674701L; TC: ±100ppm/°C; Table: Resistors SMD; Part Number: R0402_470R_1%_0.0625W_100PPM; Component Kind: Standard; Component Type: Standard; Pin Count: 2; Value: 470; Status: Not recommended; Power: 0.0625W; Tolerance: ±1%; Manufacturer Part Number: R0402_470R_1%_0.0625W_100PPM; Case: 0402; Mounted: Yes; Socket: No; SMD: Yes; Manufacturer1 Example: YAGEO PHYCOMP; Manufacturer1 ComponentHeight: 0.4mm; HelpURL: \\cern.ch\dfs\Applications\Altium\Datasheets\R0402_Phycomp_RC0402.pdf; Author: CERN DEM JLC; CreateDate: 12/3/2007; LatestRevisionDate: 10/17/2012
RN1 RN2 = RN_100R_VISHAY_ACASA1000E1000P100: DIL8 Resistor Network 4 Isolated Resistor 0.25%; Part Description: Chip Resistor Array , 4 Isolated Resistor (Convex Terminal), ACAS 0612 Serie; Manufacturer: VISHAY  BEYSCHLAG; Power: 0.1W; TC: ±25ppm/°C; Table: Resistor Networks SMD; Part Number: RN_100R_VISHAY_ACASA1000E1000P100; Component Kind: Standard; Component Type: Standard; Pin Count: 8; Value: 100; Tolerance: ±0.25%; Manufacturer Part Number: ACASA1000E1000P100; Case: 1206; Mounted: Yes; Socket: No; SMD: Yes; ComponentHeight: 0.55mm; HelpURL: \\cern.ch\dfs\Applications\Altium\Datasheets\RN_VISHAY_ACAS0612.pdf; Author: CERN DEM JLC; CreateDate: 5/12/2011; LatestRevisionDate: 5/12/2011
SF1-SF3 = B3717: FILTER SAW 866.5MHZ SMD; Manufacturer: TDK EPCOS; Load Impedance: 50R; Insertion Loss: 2.1dB; Frequency Tolerance: 100ppm; Supplier 1: Newark; Manufacturer Part Number: B39871B3717U410; Stock 1: 0; Pricing 1: 9000 = 0.74900 (USD); RoHS: Yes; Mount: Surface Mount; Case/Package: SMD/SMT; Number of Pins: 6; Contact Plating: Gold; Min Operating Temperature: -40°C; Max Operating Temperature: 125°C; Package Quantity: 1; Frequency: 866.5MHz; Packaging: Tape and Reel; Impedance: 50R; Termination: SMD/SMT; Length: 3mm; Height: 0.043inch; Width: 0.118inch; Radiation Hardening: No; ComponentLink1URL: https://datasheet.ciiva.com/16552/b3717-16552772.pdf?src-supplier=Avnet+Europe; ComponentLink1Description: https://datasheet.ciiva.com/16552/b3717-16552772.pdf?src-supplier=Avnet+Europe; ComponentLink2URL: https://datasheet.ciiva.com/14132/loepcos-breitbandfiler-b3981-en-14132665.pdf?src-supplier=Distrelec; ComponentLink2Description: https://datasheet.ciiva.com/14132/loepcos-breitbandfiler-b3981-en-14132665.pdf?src-supplier=Distrelec; ComponentLink3URL: https://datasheet.ciiva.com/4548/b3717-58819-4548109.pdf?src-supplier=Mouser; ComponentLink3Description: https://datasheet.ciiva.com/4548/b3717-58819-4548109.pdf?src-supplier=Mouser; ComponentLink4URL: https://datasheet.ciiva.com/1024/b3717-1024476.pdf?src-supplier=Digi-Key; ComponentLink4Description: https://datasheet.ciiva.com/1024/b3717-1024476.pdf?src-supplier=Digi-Key; ComponentLink5URL: https://datasheet.ciiva.com/1024/b3717-1024478.pdf?src-supplier=Digi-Key; ComponentLink5Description: https://datasheet.ciiva.com/1024/b3717-1024478.pdf?src-supplier=Digi-Key; ComponentLink6URL: https://datasheet.ciiva.com/3073/b3717-3073166.pdf?src-supplier=Avnet; ComponentLink6Description: https://datasheet.ciiva.com/3073/b3717-3073166.pdf?src-supplier=Avnet; Supplier Part Number 1: 29M0920
U3 = SX1308: IC DIGITAL BASEBAND LORA; Manufacturer: Semtech; Manufacturer Part Number: SX1308IMLTRT; Supplier 1: Digi-Key; Stock 1: 4764; Pricing 1: 1 = 32.76000, 10 = 30.24000, 25 = 27.72000, 100 = 25.62000, 250 = 24.36000 (USD); RoHS: No; ComponentLink1URL: https://media.digikey.com/pdf/Data%20Sheets/Semtech%20PDFs/SX1308_Web.pdf?src-supplier=Digi-Key; ComponentLink1Description: https://media.digikey.com/pdf/Data%20Sheets/Semtech%20PDFs/SX1308_Web.pdf?src-supplier=Digi-Key; Supplier Part Number 1: SX1308IMLTRTCT-ND
U4 U6 = SX1257: IC RF TXRX 802.15.4 32WFQFN; Manufacturer: Semtech; Manufacturer Part Number: SX1257IWLTRT; Frequency: 862MHz; Interface: SPI; Current - Receiving: 20mA; Current - Transmitting: 58mA; Number of GPIO: 4; Supplier 1: Digi-Key; Stock 1: 2577; Pricing 1: 1 = 7.56000, 10 = 6.93000, 25 = 6.30000, 100 = 5.67000, 250 = 5.19752, 500 = 4.72500, 1000 = 4.25250 (USD); RoHS: Yes; Min Operating Temperature: -40°C; Max Operating Temperature: 85°C; Packaging: Tape and Reel; Lead Free: Lead Free; ComponentLink1URL: http://www.mouser.com/ds/2/761/down-766660.pdf?src-supplier=Mouser; ComponentLink1Description: http://www.mouser.com/ds/2/761/down-766660.pdf?src-supplier=Mouser; ComponentLink2URL: http://www.semtech.com/images/datasheet/sx1257.pdf?src-supplier=Digi-Key; ComponentLink2Description: http://www.semtech.com/images/datasheet/sx1257.pdf?src-supplier=Digi-Key; ComponentLink3URL: https://www.semtech.com/uploads/documents/DS_SX1257_V1.2.pdf?src-supplier=Digi-Key; ComponentLink3Description: https://www.semtech.com/uploads/documents/DS_SX1257_V1.2.pdf?src-supplier=Digi-Key; Supplier Part Number 1: SX1257IWLTRTCT-ND
U5 = SE2435L: IC FRONT END 930MHZ ISM 24QFN; Manufacturer: Skyworks Solutions; Manufacturer Part Number: SE2435L-R; Operating Supply Current: 50mA; Operating Supply Voltage: 3V; Supplier 1: Digi-Key; Stock 1: 54229; Pricing 1: 1 = 3.05000, 10 = 2.72600, 25 = 2.45320, 100 = 2.23510, 250 = 2.01704, 500 = 1.80990, 1000 = 1.52642 (USD); RoHS: Yes; Case/Package: QFN; Weight: 0.032741oz; Min Operating Temperature: -40°C; Max Operating Temperature: 85°C; Frequency: 930MHz; Packaging: Tape and Reel; Package Quantity: 1; ComponentLink1URL: https://www.verical.com/server-webapp/html/getDatasheet?partID=660463&src-supplier=Verical; ComponentLink1Description: https://www.verical.com/server-webapp/html/getDatasheet?partID=660463&src-supplier=Verical; ComponentLink2URL: http://www.skyworksinc.com/uploads/documents/SE2435L_202412I.pdf?src-supplier=Digi-Key; ComponentLink2Description: http://www.skyworksinc.com/uploads/documents/SE2435L_202412I.pdf?src-supplier=Digi-Key; ComponentLink3URL: http://www.skyworksinc.com/uploads/documents/SE2435L_DS.pdf?src-supplier=Mouser; ComponentLink3Description: http://www.skyworksinc.com/uploads/documents/SE2435L_DS.pdf?src-supplier=Mouser; Supplier Part Number 1: 863-1349-1-ND